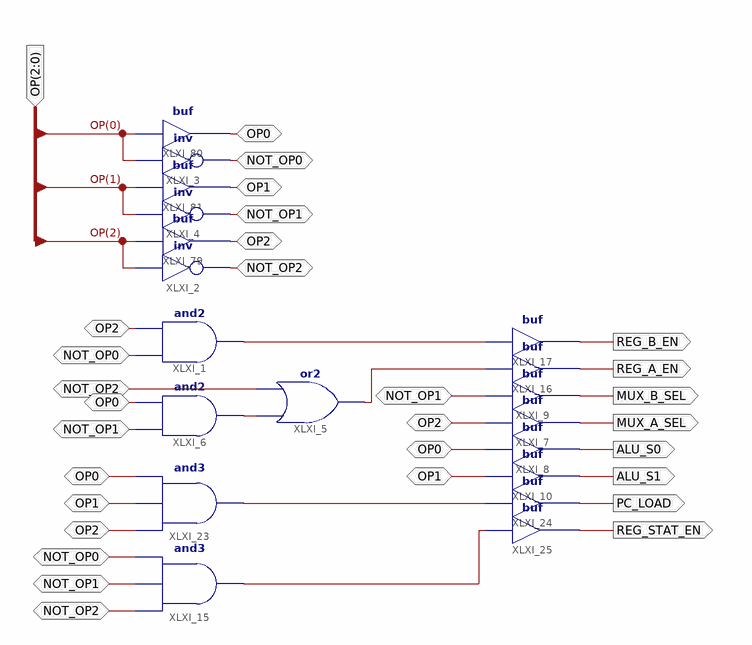
[diagram p0: schematic sheet 1]
// Xilinx ISE schematic my_decoder.sch (virtex6) as structural Verilog: 19 symbols, 15 ports
module my_decoder (
  input  [2:0] OP,
  inout  NOT_OP1,
  inout  OP2,
  inout  OP0,
  inout  OP1,
  inout  NOT_OP0,
  inout  NOT_OP2,
  output REG_A_EN,
  output ALU_S0,
  output ALU_S1,
  output REG_B_EN,
  output MUX_B_SEL,
  output MUX_A_SEL,
  output PC_LOAD,
  output REG_STAT_EN
);

  wire asdafasdf, asdfasdfzxcvzx, asdfcvzz, STATEN, XLXN_26;

  not XLXI_4 (NOT_OP1, OP[1]);
  buf XLXI_81 (OP1, OP[1]);
  not XLXI_3 (NOT_OP0, OP[0]);
  buf XLXI_80 (OP0, OP[0]);
  not XLXI_2 (NOT_OP2, OP[2]);
  buf XLXI_79 (OP2, OP[2]);
  buf XLXI_17 (REG_B_EN, asdafasdf);
  buf XLXI_16 (REG_A_EN, asdfcvzz);
  buf XLXI_9 (MUX_B_SEL, NOT_OP1);
  buf XLXI_7 (MUX_A_SEL, OP2);
  buf XLXI_8 (ALU_S0, OP0);
  buf XLXI_10 (ALU_S1, OP1);
  buf XLXI_24 (PC_LOAD, asdfasdfzxcvzx);
  buf XLXI_25 (REG_STAT_EN, STATEN);
  or XLXI_5 (asdfcvzz, XLXN_26, NOT_OP2);
  and XLXI_6 (XLXN_26, NOT_OP1, OP0);
  and XLXI_1 (asdafasdf, NOT_OP0, OP2);
  and XLXI_23 (asdfasdfzxcvzx, OP2, OP1, OP0);
  and XLXI_15 (STATEN, NOT_OP2, NOT_OP1, NOT_OP0);
endmodule
